# EAGLE board ESP32- 3.5 TFT Display(RGB)-V2.0 (EAGLE 9.5.1)
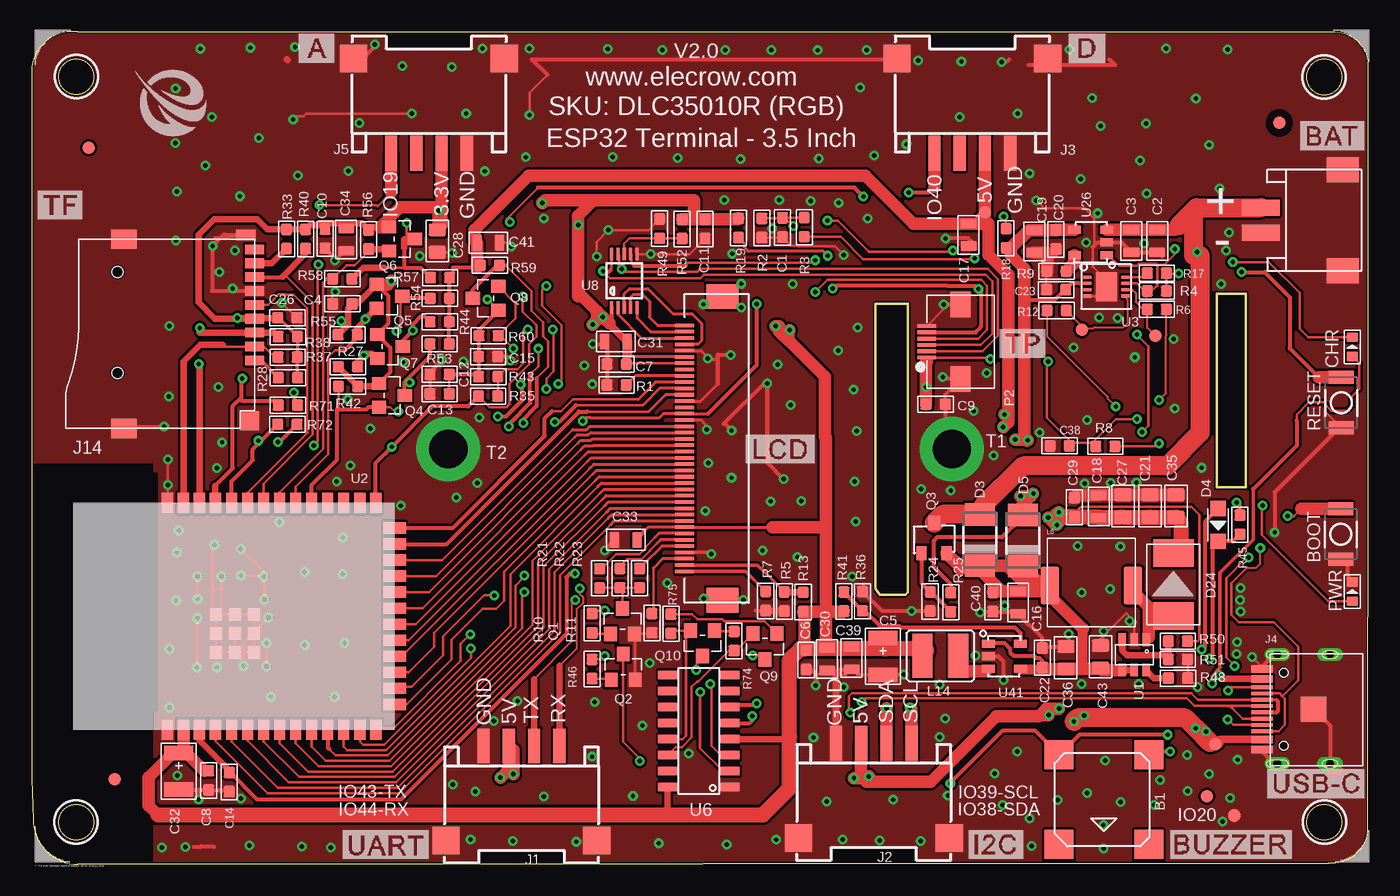
[diagram p2: board, top side]
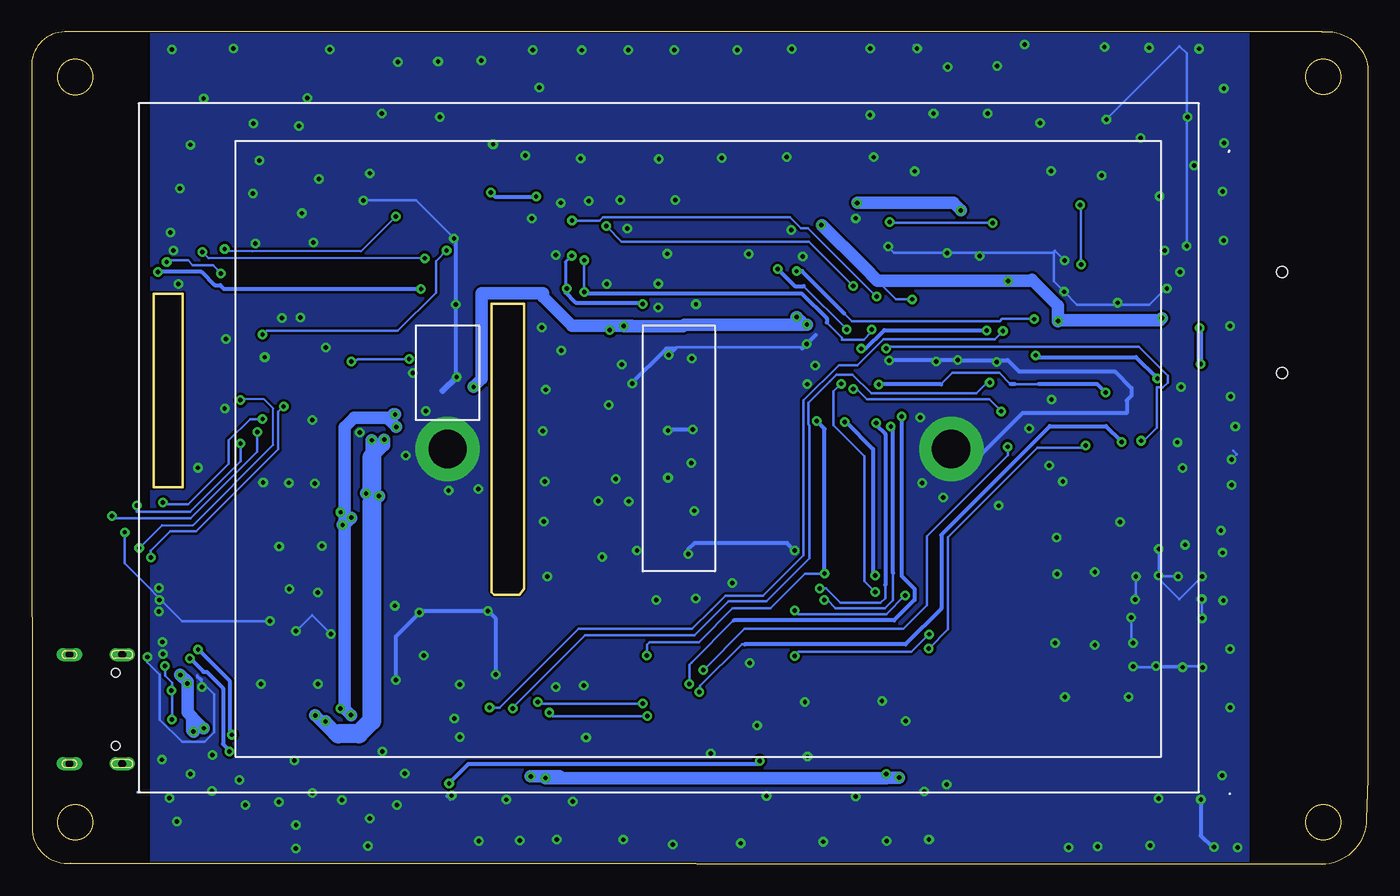
[diagram p3: board, bottom side, seen from below]

Size 106 x 66.03 mm. Coordinates in mm from the lower left corner, seen from the top.
Outline: 3.68,66 103.12,66 arc-90 106,63.49 106,36.62 105.96,2.61 arc-90 102.91,0.1 3.67,0 arc-90 0.14,3.59 0,6.77 0,63.2 arc-90 3.68,66
Outline: 94,45.26 94,29.88 96.3,29.88 96.3,45.26 94,45.26
Outline: 66.95,44.43 66.95,21.83 67.3,21.38 69.3,21.38 69.5,21.58 69.5,44.43 69.3,44.44 66.98,44.44 66.95,44.43
Outline: circle at 102.53,62.43 radius 1.4
Outline: circle at 3.56,62.46 radius 1.4
Outline: circle at 3.54,3.35 radius 1.4
Outline: circle at 102.55,3.35 radius 1.4
Copper layers (1*16): Top 0.035mm / dielectric 1.5mm / Bottom 0.035mm
Design rules "default *": minimum track width 6mil, minimum drill 0.35mm, track to track 4mil, track to pad 5mil, pad to pad 5mil, via to via 6mil, smd to smd 4mil, copper to edge 5mil, drill to drill 5mil, minimum pad ring 6mil, minimum via ring 8mil, stop-mask expansion 4mil, vias tented up to drill 30mil, thermal gap 6mil
Net classes: 0 default: width 0.127 mm, drill 0.203 mm, clearance 0.203 mm; 1 New Class: width 0.127 mm, drill 0.203 mm, clearance 0.203 mm to class 0, clearance 0.203 mm
tRestrict: area 98,57.8 to 100,59.8

## Footprints (pad centres in the part's own frame; a part is rotated, then mirrored left to right if it is on the bottom)
MLT-8530 = smd 2.3 x 2.3: 1 -3.55,3.55; 2 -3.55,-3.55; 3 3.55,-3.55; 4 3.55,3.55
2P-2.0-M = smd 1.27 x 3: 1 -1,-0.5; 2 1,-0.5 | smd 2 x 2.5: 3 -4,6; 4 4,6
157SW = smd 1.016 x 1.981: 1 0,0; 2 4,0
C0603 = smd 0.889 x 0.889: 1 -0.762,0; 2 0.762,0
0805_S = smd 0.762 x 1.27: 1 -0.889,0; 2 0.889,0
AVX-B = smd 1.143 x 2.286: + -1.46,0; - 1.46,0
DISCRETE_C0603 = smd 0.889 x 0.889: 1 -0.762,0; 2 0.762,0
0805 = smd 1.016 x 1.397: 1 -0.889,0; 2 0.889,0
0603 = smd 0.889 x 0.889: 1 -0.762,0; 2 0.762,0
LED-0603 = smd 0.762 x 0.889: + -0.762,0; - 0.762,0
DO-214AC = smd 1.8 x 2.4: A 2.025,0; C -2.025,0
SOD-323 = smd 1.2 x 1.2: 1 1.3,0; 2 -1.3,0
214AB = smd 2.2 x 3.2: 1 -2.5,0; 2 2.5,0
4P-SMD-2.0-90D = smd 0.965 x 2.74: 1 -3,-0.1; 2 -1,-0.1; 3 1,-0.1; 4 3,-0.1 | smd 2.159 x 2.184: SS1 -5.974,7.4; SS2 5.974,7.4
KEVIN_3.0TYPEC-SMD = smd 0.3 x 1.7: A1 -3.35,0.5; A4 -2.55,0.5; A5 -1.25,0.5; A6 -0.25,0.5; A7 0.25,0.5; A8 1.25,0.5; A9 2.55,0.5; A12 3.35,0.5; B1 3.05,0.5; B4 2.25,0.5; B5 1.75,0.5; B6 0.75,0.5; B7 -0.75,0.5; B8 -1.75,0.5; B9 -2.25,0.5; B12 -3.05,0.5 | drill 0.6 pad 1.016 long: P$1 -4.325,-0.72; P$2 4.325,-0.72; P$3 -4.325,-4.9; P$4 4.325,-4.9 | smd 2 x 2: P$5 0,-3.597 | hole 0.68: -2.89,-1.22; 2.89,-1.22
9P-SMD-W/-RING = smd 1.524 x 0.762: 1 0,4.4; 2 0,3.3; 3 0,2.2; 4 0,1.1; 5 0,0; 6 0,-1.1; 7 0,-2.2; 8 0,-3.3; 9 0,-4.4 | smd 1.524 x 0.8: G1 0.7,-5.546 | smd 2.032 x 1.524: G2 10.373,-5.2; G3 10.373,9.8 | smd 1.524 x 1.524: G4 0.392,9.181 | hole 0.889: 10.9,-2.6; 10.9,5.4
L773 = smd 1.5 x 3: 1 -3.29,-0.254; 2 3.29,-0.254
CD32 = smd 3.5 x 1.6: 1 0,1.409; 2 0,-1.409
TFT-3.5寸40PIN = smd 1.524 x 0.28: 1 0,9.5; 2 0,9; 3 0,8.5; 4 0,8; 5 0,7.5; 6 0,7; 7 0,6.5; 8 0,6; 9 0,5.5; 10 0,5; 11 0,4.5; 12 0,4; 13 0,3.5; 14 0,3; 15 0,2.5; 16 0,2; 17 0,1.5; 18 0,1; 19 0,0.5; 20 0,0; 21 0,-0.5; 22 0,-1; 23 0,-1.5; 24 0,-2; 25 0,-2.5; 26 0,-3; 27 0,-3.5; 28 0,-4; 29 0,-4.5; 30 0,-5; 31 0,-5.5; 32 0,-6; 33 0,-6.5; 34 0,-7; 35 0,-7.5; 36 0,-8; 37 0,-8.5; 38 0,-9; 39 0,-9.5; 40 0,-10 | smd 2.54 x 1.93: P$1 3,11.8 | smd 2.54 x 2: P$2 3,-12.3
PAD-1.0MM = smd 1 x 1: P$1 0,0
SMD8-50P-740L535W = smd 0.3 x 1.5: 1 -1.25,0; 2 -0.75,0; 3 -0.25,0; 4 0.25,0; 5 0.75,0; 6 1.25,0 | smd 2 x 1.6: 7 2.95,-2.68; 8 -2.95,-2.68
SOT23 = smd 1.016 x 1.143: 1 -0.95,-1.016; 2 0.95,-1.016; 3 0,1.016
SOT23@1 = smd 1.016 x 1.143: 1 -0.95,-1.016; 2 0.95,-1.016; 3 0,1.016
SOT-23 = smd 1.1 x 0.8: 1 1.2,-1; 2 1.2,1 | smd 1.1 x 0.9: 3 -1.2,0
R0603 = smd 0.889 x 0.889: 1 -0.762,0; 2 0.762,0
DISCRETE_R0603 = smd 0.889 x 0.889: 1 -0.762,0; 2 0.762,0
LCD3.5寸 = smd 0.305 x 0.152: P$1 0,0
3M-5 = drill 3.048 pad 5.08: 1 0,0
A_XBJ_SOT23-6 = smd 0.6 x 1: 1 -0.95,-1.2; 2 0,-1.2; 3 0.95,-1.2; 4 0.95,1.2; 5 0,1.2; 6 -0.95,1.2
ESP32-S3 = smd 1.6 x 0.9: 1 0,18.01; 2 0,16.74; 3 0,15.47; 4 0,14.2; 5 0,12.93; 6 0,11.66; 7 0,10.39; 8 0,9.12; 9 0,7.85; 10 0,6.58; 11 0,5.31; 12 0,4.04; 13 0,2.77; 14 0,1.5; 27 18,1.5; 28 18,2.77; 29 18,4.04; 30 18,5.31; 31 18,6.58; 32 18,7.85; 33 18,9.12; 34 18,10.39; 35 18,11.66; 36 18,12.93; 37 18,14.2; 38 18,15.47; 39 18,16.74; 40 18,18.01 | smd 0.9 x 1.8: 15 2,0; 16 3.28,0; 17 4.55,0; 18 5.82,0; 19 7.09,0; 20 8.36,0; 21 9.63,0; 22 10.9,0; 23 12.17,0; 24 13.44,0; 25 14.71,0; 26 16,0 | smd 1 x 1: 41 7.64,11.16; 42 9.14,11.16; 43 6.14,11.16; 44 6.14,14.16; 45 7.64,12.66; 46 9.14,12.66; 47 7.64,14.16; 48 9.14,14.16; 49 6.14,12.66
DFN8 = smd 0.61 x 0.25: 1 -1.5,0.75; 2 -1.5,0.25; 3 -1.5,-0.25; 4 -1.5,-0.75; 5 1.5,-0.75; 6 1.5,-0.25; 7 1.5,0.25; 8 1.5,0.75 | smd 1.7 x 2.3: P$9 0,0
SOP-16 = smd 0.66 x 1.5: 1 -4.445,-2.475; 2 -3.175,-2.475; 3 -1.905,-2.475; 4 -0.635,-2.475; 5 0.635,-2.475; 6 1.905,-2.475; 7 3.175,-2.475; 8 4.445,-2.475; 9 4.445,2.475; 10 3.175,2.475; 11 1.905,2.475; 12 0.635,2.475; 13 -0.635,2.475; 14 -1.905,2.475; 15 -3.175,2.475; 16 -4.445,2.475
MSOP10 = smd 0.25 x 1: 1 -1,-2.113; 2 -0.5,-2.113; 3 0,-2.113; 4 0.5,-2.113; 5 1,-2.113; 6 1,2.113; 7 0.5,2.113; 8 0,2.113; 9 -0.5,2.113; 10 -1,2.113
SOP23-5 = smd 1 x 0.635: 1 -1.27,1; 2 -1.27,0; 3 -1.27,-1; 4 1.27,-1; 5 1.27,1
SOT23-5 = smd 1 x 0.635: 1 -1.27,1; 2 -1.27,0; 3 -1.27,-1; 4 1.27,-1; 5 1.27,1

## Placement (x,y rotation side)
B1  MLT-8530  [MLT-8530]  85.05,5.13 270 top
BAT  CON-80-2P-M  [2P-2.0-M]  98,51.07 270 top
BOOT  BUTTON  [157SW]  103.84,28.2 270 top
C1  100nF  [C0603]  59.56,50.49 90 top
C2  10uF  [0805_S]  89.28,49.43 90 top
C3  10uF  [0805_S]  87.23,49.43 90 top
C4  100nF  [C0603]  24.66,44.44 0 top
C5  47uF/10v  [AVX-B]  67.53,16.49 270 top
C6  100nF  [C0603]  61.44,16.21 270 top
C7  100nF  [C0603]  46.41,39.67 180 top
C8  1uF  [C0603]  14.04,6.66 270 top
C9  100nF  [C0603]  71.71,36.48 180 top
C10  1uF  [C0603]  23.28,49.61 270 top
C11  100nF  [C0603]  53.42,50.37 90 top
C12  100nF  [C0603]  32.37,38.85 180 top
C13  100nF  [C0603]  32.36,37.3 180 top
C14  1uF  [C0603]  15.69,6.53 270 top
C15  0.1uF  [DISCRETE_C0603]  36.22,40.26 180 top
C16  10uF  [0805_S]  78.25,20.76 90 top
C17  10uF  [0805_S]  74.31,49.91 90 top
C18  10uF  [0805_S]  84.65,28.37 270 top
C19  10uF  [0805_S]  79.54,49.4 90 top
C20  100nF  [C0603]  81.25,49.54 270 top
C21  22uF  [0805]  88.71,28.41 270 top
C22  1uF  [0603]  80.17,16.38 270 top
C23  100nF  [C0603]  81.27,45.56 180 top
C26  100nF  [0603]  20.3,43.34 0 top
C27  22uF  [0805]  86.57,28.41 270 top
C28  22uF  [0805]  32.17,49.42 90 top
C29  100nF  [0603]  82.72,28.32 270 top
C30  10uF  [0805_S]  63.1,16.26 90 top
C31  10uF  [0805_S]  46.35,41.46 0 top
C32  47uF/10v  [AVX-B]  11.68,7.38 270 top
C33  10uF  [0805_S]  47.13,25.73 0 top
C34  10uF  [0805_S]  24.96,49.53 90 top
C35  22uF  [0805]  90.77,28.41 270 top
C36  22uF  [0805]  82.04,16.38 270 top
C38  100nF  [DISCRETE_C0603]  81.55,33.18 0 top
C39  10uF  [0805_S]  65.04,16.35 90 top
C40  0.1uF  [0603]  76.25,20.8 270 top
C41  10uF  [0805_S]  36.23,49.28 180 top
C43  22uF  [0805]  84.79,16.46 270 top
CHR  RED  [LED-0603]  104.75,41.03 90 top
D3  IN5817  [DO-214AC]  75.21,25.72 90 top
D4  1N5819WS  [SOD-323]  94.11,26.91 270 top
D5  SS34  [DO-214AC]  78.63,25.68 90 top
D24  SS34B/SMB  [214AB]  90.57,22.19 90 top
J1  [4P-SMD-2.0-90D]  38.86,9.29 180 top
J2  [4P-SMD-2.0-90D]  66.8,9.5 180 top
J3  [4P-SMD-2.0-90D]  74.62,56.48 0 top
J4  KEVIN_TYPEC-3.0-16P-SMD  [KEVIN_3.0TYPEC-SMD]  98.09,12.3 90 top
J5  [4P-SMD-2.0-90D]  31.52,56.48 0 top
J14  SD Card  [9P-SMD-W/-RING]  17.7,44.36 180 top
L6  33UH  [L773]  84.07,22.36 0 top
L14  CD32_950MA  [CD32]  72.08,16.53 270 top
LCD  TFT-40P-3.5  [TFT-3.5寸40PIN]  51.8,33.23 0 top
P1  PADPAD-1.0MM  [PAD-1.0MM]  98.98,58.78 0 top
P2  AFC01-S06FCC-00  [SMD8-50P-740L535W]  71,41.43 90 top
P3  PADPAD-1.0MM  [PAD-1.0MM]  6.61,6.74 0 top
P4  PADPAD-1.0MM  [PAD-1.0MM]  75.62,51.7 0 top
P5  PADPAD-1.0MM  [PAD-1.0MM]  4.53,56.83 0 top
P6  PADPAD-1.0MM  [PAD-1.0MM]  93.21,5.41 0 top
P10  PADPAD-1.0MM  [PAD-1.0MM]  93.89,9.51 0 top
P11  PADPAD-1.0MM  [PAD-1.0MM]  89.14,41.89 0 top
P12  PADPAD-1.0MM  [PAD-1.0MM]  83.31,42.4 0 top
P13  PADPAD-1.0MM  [PAD-1.0MM]  95.4,3.87 0 top
PWR  Green  [LED-0603]  104.75,21.63 90 top
Q1  NMOS7002  [SOT23]  46.87,19.29 0 top
Q2  S9013  [SOT23@1]  46.93,15.65 0 top
Q3  PMOS-3401-4A  [SOT-23]  71.58,25.87 270 top
Q4  BSN20  [SOT23]  28.59,37.18 270 top
Q5  BSN20  [SOT23]  28.39,45.05 270 top
Q6  BSN20  [SOT23]  29.38,49.58 270 top
Q7  BSN20  [SOT23]  28.44,41.05 270 top
Q8  BSN20  [SOT23]  36.01,44.88 90 top
Q9  S9013  [SOT23@1]  58.18,17.27 180 top
Q10  S9013  [SOT23@1]  53.22,17.52 180 top
R1  0R  [R0603]  46.4,38.01 180 top
R2  100K  [DISCRETE_R0603]  57.92,50.46 90 top
R3  100K  [DISCRETE_R0603]  61.29,50.52 270 top
R4  NC  [R0603]  89.25,45.46 180 top
R5  NC  [R0603]  59.7,20.84 90 top
R6  0R  [R0603]  89.25,44 180 top
R7  0R  [R0603]  58.23,20.88 90 top
R8  2K  [R0603]  85.17,33.14 180 top
R9  2K  [DISCRETE_R0603]  81.3,47.02 180 top
R10  10k  [R0603]  44.46,19.11 270 top
R11  0R  [R0603]  49.21,19.13 90 top
R12  0R  [R0603]  81.31,43.91 0 top
R13  0R  [R0603]  61.21,20.81 270 top
R17  5.1K  [DISCRETE_R0603]  89.25,46.88 180 top
R18  5.1K  [DISCRETE_R0603]  77.3,49.64 90 top
R19  10K  [DISCRETE_R0603]  56.08,50.45 90 top
R21  10R  [R0603]  45.06,22.68 90 top
R22  10R  [R0603]  46.67,22.69 90 top
R23  10R  [R0603]  48.23,22.69 90 top
R24  10K  [DISCRETE_R0603]  71.28,20.84 90 top
R25  1K  [DISCRETE_R0603]  72.91,20.78 90 top
R27  10k  [R0603]  25.09,39.45 0 top
R28  47K  [R0603]  20.34,38.59 180 top
R33  47K  [R0603]  20.22,49.58 270 top
R35  NC  [DISCRETE_R0603]  36.21,37.12 0 top
R36  22K 1%  [R0603]  65.92,20.87 270 top
R37  47K  [R0603]  20.32,40.21 0 top
R38  47K  [R0603]  20.33,41.84 0 top
R40  47K  [R0603]  21.74,49.58 90 top
R41  100K 1%  [R0603]  64.44,20.83 270 top
R42  10k  [R0603]  25.1,37.89 180 top
R43  10K  [DISCRETE_R0603]  36.22,38.67 180 top
R44  10k  [R0603]  32.38,43.02 0 top
R45  5.1R  [R0603]  95.84,26.93 270 top
R46  1K  [DISCRETE_R0603]  44.46,15.49 270 top
R48  20K  [DISCRETE_R0603]  90.94,14.77 180 top
R49  0R  [DISCRETE_R0603]  49.82,50.41 270 top
R50  73.2K  [DISCRETE_R0603]  90.91,17.7 180 top
R51  10K  [DISCRETE_R0603]  90.91,16.25 0 top
R52  NC  [DISCRETE_R0603]  51.6,50.37 90 top
R53  10k  [R0603]  32.37,41.26 0 top
R54  10k  [R0603]  32.38,44.87 0 top
R55  10k  [R0603]  25.07,42 180 top
R56  10k  [R0603]  26.73,49.54 90 top
R57  10k  [R0603]  32.4,46.51 0 top
R58  NC  [R0603]  24.66,46.43 0 top
R59  10k  [R0603]  36.34,47.48 180 top
R60  10k  [R0603]  36.25,41.91 180 top
R71  22R  [DISCRETE_R0603]  20.33,36.41 0 top
R72  470R  [DISCRETE_R0603]  20.29,34.89 0 top
R74  1K  [DISCRETE_R0603]  55.72,17.7 270 top
R75  1K  [DISCRETE_R0603]  50.71,19.07 270 top
RESET  BUTTON  [157SW]  103.88,38.62 270 top
SM  TFT-3.5  [LCD3.5寸]  97.5,5.73 0 bottom
T1  3M-5  [3M-5]  73,32.93 0 top
T2  3M-5  [3M-5]  33.05,32.93 0 top
U1  HM1548C  [A_XBJ_SOT23-6]  87.46,16.61 180 top
U2  ESP32-S  [ESP32-S3]  28.8,10.68 90 top
U3  STC8G1K08  [DFN8]  85.25,45.81 0 top
U6  CH340C  [SOP-16]  52.93,10.57 90 top
U8  NC\NS2009  [MSOP10]  47.01,46.27 0 top
U26  4054A  [SOP23-5]  84,49.31 180 top
U41  HX3406  [SOT23-5]  77.16,16.51 0 top
U$27  [LOGO]  11.58,61.49 0 top
U$53  [TOP-SMT-ESP32]  0.28,0.22 0 top

## Tracks (layer width: path | path; a pad name or v marks a point on that pad's centre or on a via)
+5V  (via drill 0.35)
  Top 0.2: 83.06,28.18 82.72,27.83 C29.2
  Top 0.203: R50.1 92.46,17.7 92.63,17.86 92.63,27.73 92,28.36 83.25,28.36 83.06,28.18 | C27.2 86.41,27.52 | P4.P$1 75.62,51.51 75.62,51.5
  Top 0.3: R53.2 33.13,43.01 R44.2 R54.2 33.14,46.5 R57.2 33.42,46.77 33.42,47.31 35.32,47.31 35.41,47.31 R59.2
  Top 1: 75.83,50.8 75.8,50.8 C17.2 69.95,50.8 66.14,54.61 39.43,54.61 35.13,50.31 35.13,49.5 C41.2 35.34,47.33 35.32,47.31 | 75.83,50.8 75.88,50.8 75.88,48.33 77.47,46.74 77.47,35.37 | 75.83,50.8 75.38,51.26 75.62,51.5 | J3.3 P4.P$1 | v77.06,34.69 77.09,34.66 77.47,35.04 77.47,35.37 | v81.33,26.92 81.33,26.98 81.9,27.55 | v80.67,11.83 79.97,11.83 | 65.95,6.84 65.77,7.02 | J2.3 65.77,9.57 65.77,7.02 | 65.77,7.02 65.59,6.84 | v37.19,6.87 37.86,7.54 J1.3 38.22,9.03 v38.22,7.15 | 79.97,11.83 79.89,11.75 76.52,11.75 71.33,6.56 66.23,6.56 65.95,6.84 | 79.97,11.83 80.48,12.34 v81.5,12.34 | v81.33,26.92 81.33,27.76 v81.48,27.92 | v65.23,6.84 65.59,6.84 | 65.59,6.84 65.95,6.84 | v66.41,6.97 66.28,6.84 65.95,6.84 | v77.17,35.67 77.47,35.37 | v81.33,26.92 81.22,26.92 v80.64,27.5
  Top 1.2: C29.2 81.9,27.55 | 84.69,27.52 82.75,27.52 C29.2 | C18.2 84.69,27.52 | 84.69,27.52 86.41,27.52 | C27.2 C21.2 C35.2 91.14,27.15 91.14,24.77 91.06,24.69 D24.2 | C29.2 81.53,27.55 81.33,27.76
  Bottom 1: v77.06,34.69 77.67,35.29 77.54,35.42 | 77.54,35.42 80.4,35.42 81.17,34.65 81.17,26.92 | v81.33,26.92 81.25,26.84 81.17,26.92 | 81.17,26.92 81.17,12.33 v80.67,11.83 | v65.23,6.84 64,6.84 | 64,6.84 38.21,6.84 38.18,6.87 v37.19,6.87 | 77.54,35.42 77.3,35.67 v77.17,35.67 | 64,6.84 64.13,6.97 v66.41,6.97 | 81.17,26.92 80.64,27.45 v80.64,27.5
BAT+  (via drill 0.35)
  Top 0.152: v92.45,48.54 92.19,48.28 92.15,48.28
  Top 0.203: R3.2 64.2,49.76 65.96,47.99 74.76,47.99 v74.82,48.05 | 92.67,48.28 92.15,48.28
  Top 0.5: D3.A 75.46,28
  Top 1: U26.3 C3.2 C2.2 | C2.2 | C2.2 90.66,50.32 91.01,50.66 | 75.46,28.42 75.46,28
  Top 1.5: BAT.1 92.41,52.07 92.15,51.8 | 91.01,50.66 92.15,51.8 | 92.15,51.8 92.15,48.28 | 92.67,48.28 92.67,34.2 90.07,31.6 78.65,31.6 75.46,28.42 | D3.A 72.25,27.74 Q3.3
  Bottom 0.152: v74.82,48.05 91.96,48.05 v92.45,48.54
DTR
  Top 0.203: R75.2 50.94,18.54 Q10.2 51.91,18.18 51.91,10.19 51.64,9.92 51.63,9.93 U6.13
EN  (via drill 0.35)
  Top 0.203: v57.19,16.56 57.87,16.56 Q9.3
  Top 0.25: R19.1 56.53,49.23 56.53,48.91 56.84,48.61 62.81,48.61 v63.16,48.26 v63.16,48.25 | 53.62,35.73 LCD.15 50.11,35.73 49.75,35.37 44.36,35.37 44.34,35.39 43.96,35.39 v43.72,35.15
  Top 0.3: P2.5 74.86,42.18 75.28,42.6 75.28,45.43 v75.1,45.6 74.85,45.86 72.7,45.86 63.75,45.86 v63.54,45.65 | C14.1 15.76,7.3 17.87,5.18 29.32,5.18 42.42,18.28 42.42,22.78 42.69,23.06 v43.11,23.06 | v95.97,46.98 95.95,46.96 97.81,46.96 99.8,44.96 99.8,40.91 102.09,38.62 | 53.62,35.73 53.64,35.73 57.53,39.62 v57.53,44.42
  Top 0.5: U2.3 13.35,10.66 13.35,9.82 15.69,7.47 C14.1
  Top 1: RESET.1 102.09,38.62
  Bottom 0.203: v43.11,23.06 44.65,23.06 47.41,20.29 50.4,20.29 53.07,17.62 56.99,17.62 57.19,17.42 v57.19,16.56
  Bottom 0.25: v63.16,48.25 63.65,47.76 63.65,45.34 63.54,45.45 v63.54,45.65
  Bottom 0.3: v75.1,45.6 75.11,45.61 90.72,45.61 91.03,45.92 91.46,45.92 92.52,46.98 v95.97,46.98 | v43.11,23.06 43.11,34.52 43.72,35.13 v43.72,35.15 | v57.53,44.42 57.65,44.54 62.85,44.54 63.65,45.34
GHRG  (via drill 0.35)
  Top 0.152: 89.19,45.78 88.44,45.03 88.44,45.02 | R18.2 77.3,51.17 v77.11,51.36 | v90.68,48.8 90.68,48.37 89.87,47.56 89.28,47.56
  Top 0.203: U26.1 85.41,48.31 86.27,47.45 87.66,47.45 87.84,47.64 89.2,47.64 89.28,47.56 89.28,46.28 89.29,46.28 89.29,45.88 89.19,45.78 | U3.7 87.65,46.06 88.5,45.21 88.51,45.21 88.44,45.14 88.44,45.02 88.49,45.07 R4.2
  Bottom 0.152: v77.11,51.36 79.86,48.61 88.49,48.61 88.5,48.61 90.57,48.61 90.68,48.72 v90.68,48.8
GND  (via drill 0.35)
  Top 0.152: C23.2 80.51,46.96 80.57,47.02
  Top 0.203: 103.79,34.7 102.59,35.91 102.59,35.38 | v10.52,34.72 7.49,34.72 J14.G3 | 14.38,21.79 15.09,21.79 | U2.49 U2.43 U2.41 U2.42 U2.46 15.09,19.82 15.09,21.79 | U2.49 U2.44 U2.48 14.38,19.82 14.38,21.79 | U2.49 U2.45 | 10.79,28.47 U2.40 10.79,32.06 v10.82,32.09 | 14.38,24.88 14.38,21.79 | 27.3,64.93 v27.23,64.99 | 40.91,62.59 39.5,61.18 v39.5,59.42 | 15.09,21.79 15.09,22.73 15.07,22.75 v15.07,22.82 | v16.62,22.9 18.32,22.9 v18.41,22.81 | v18.48,20.99 18.48,23.1 v16.59,24.99 | v13.16,22.81 13.16,21.04 v13.18,21.02 | v13.16,19.51 13.12,19.47 v13.12,15.59 | v18.78,19.58 16.79,17.59 v16.79,15.71 | v18.62,17.56 18.64,17.53 v18.64,15.7 | 73.77,43.6 P2.7 | R2.1 59.53,49.7 C1.1 60.24,49.05 60.77,49.05 60.8,49.02 63.71,49.02 v64.41,48.32 | Q1.2 47.97,18.27 | 47.97,18.27 49.11,18.27 R11.1 | C15.1 37.03,40.27 37.98,40.27 38.15,40.09 | Q2.2 47.88,18.18 47.97,18.27 | 62.22,15.07 62.79,15.07 C30.1 64.2,15.38 | 61.84,15.45 C6.2 | 63.84,15.02 64.59,15.02 C39.1 65.48,15.03 C5.- | R51.2 91.7,16.22 R48.1 | C28.1 33.32,48.53 v33.37,48.48 | v38.07,48.97 37.76,49.28 C41.1 | v24.09,45.4 23.85,45.16 23.85,44.48 | C26.2 21.04,43.34 v19.85,44.53 | v15.96,45.66 15.75,45.46 J14.6 | v20.75,59.07 21,59.32 21.57,59.32 21.77,59.52 v30.15,59.52 | v44.83,48.18 44.83,48.06 44.8,48.06 44.8,49.34 v45.74,50.29 48.95,50.29 R49.1 | 84.3,49.07 84.3,51.19 83.49,52 80.34,52 v79.69,52.65 | U1.2 87.46,19.07 87.58,19.19 86.84,19.93 84.79,17.87 C43.1 85.02,17.58 v85.02,18.49 | R48.1 92.04,14.77 | C36.1 82.26,17.5 v82.26,18.27 82.26,18.18 | U8.6 v49.11,48.38 52.19,48.38 C11.1 | P2.6 72.33,44.01 v72.33,44.38 | 80.52,47.01 R9.2 | C2.1 89.67,48.15 | C13.2 C12.2
  Top 0.203: R48.1 91.78,14.77 v92.49,14.06 v92.5,14.06 | v96.79,16.45 J4.A12 J4.B1 | 84.17,48.94 84.17,47.37 85.25,46.29 U3.P$9 85.25,45.22 85.04,45.01 84.99,45.06 U3.4
  Top 0.25: LCD.16 53.09,35.23 53.55,34.77 v53.55,34.49 | LCD.13 53.07,36.73 54.43,38.1 | LCD.5 53.11,40.73 53.65,40.19 | v53.62,40.11 53.72,40.01 54.41,40.01 54.43,39.98 | 65.99,22.24 65.99,21.7 R36.1
  Top 0.28: LCD.37 53.79,24.73 v53.91,24.6 | P2.8 72.47,37.27 C9.1 72.47,33.46 T1.1
  Top 0.3: v55.45,40.38 55.41,40.42 54.43,40.42 54.43,39.98 54.43,38.1 | C31.1 45.65,41.27 | 45.65,41.27 C7.2 R1.2 | v55.52,34.4 54.99,34.92 54.88,34.92 58.36,38.4 v58.36,38.12 58.36,31.83 v59.65,30.54 | J14.G1 14.6,49.65 | 23.85,44.48 C4.1 | v44.52,41.25 45.63,41.25 45.65,41.27 | 26.2,63.83 27.31,64.94 | 40.91,62.59 39.67,63.83 68.32,63.83 68.79,63.37 68.79,63.46 | 85.48,63.83 85.95,63.37 79.1,63.37 | 77.39,63.66 77.55,63.83 | P2.7 v72.33,44.38 | C32.- 13.26,5.92 | 13.26,5.92 14.02,5.92 C8.2 15.57,5.89 C14.2 | 14.46,1.38 13.48,1.38 | 13.48,1.45 13.48,1.38 | 12.88,1.38 13.48,1.38 | 13.26,5.92 v13.26,5.14 | P2.8 72.44,38.48 v72.28,38.64 | v72.49,49.63 72.51,49.65 74.28,49.65 74.61,49.32 C17.1 | v98.61,26.33 98.61,29.52 103.79,34.7 RESET.2 104.31,34.19 | BOOT.2 103.05,24.2 | 103.94,7.49 103.7,7.25 102.89,7.25 | U6.1 55.75,6.12 | J4.A12 98.56,16.63 J4.P$2 | J4.P$5 102.99,11 J4.P$3 | J4.P$1 98.56,7.98 J4.A1 J4.B12 | J14.6 14.31,45.46 14.31,48.97 v14.37,49.03 15.28,49.94 J14.G1 | C36.1 80.3,17.27 C22.1 80.17,17.95 C16.1 78.08,20.04 C40.2 75.31,20.04 v75.22,19.96 | R24.1 v69.8,20.08 67.47,20.08 R36.1 | PWR.- 104.41,22.92 104.41,24.11 104.33,24.2 BOOT.2 | BOOT.2 103.8,24.16 | 84.17,48.94 84.3,49.07 84.54,49.31 U26.2 86.46,49.31 C3.1 C2.1 | C2.1 | C10.2 24.06,48.07 v24.06,47.87 24.84,48.64 C34.1 | J14.G1 16.42,49.9 16.37,49.85 | C12.2 31.61,39.03 v32.55,39.97 | v37.99,39.93 37.66,40.27 37.03,40.27 | C5.- 69.14,15.03 v69.17,15.05 | U41.2 76.67,16.51 77.07,16.11 77.07,14.61 v77.1,14.61 | 57.44,20.12 R7.1 | 59.33,20.04 59.25,20.12 | 61.84,15.45 62.22,15.07 62.23,15.06 62.23,14.17 v62.21,14.17 | C33.1 45.47,24.96 v45.47,24.87
  Top 0.5: C10.2 23.08,48.65 | 20.33,63.74 20.24,63.83 | 25.96,63.74 25.87,63.83 | R5.1 59.67,20.12 59.25,20.12 R7.1 | J2.4 63.8,14.98 63.84,15.02 64.2,15.38
  Top 1: C35.1 C21.1 C27.1 84.69,29.3 C18.1 82.9,29.26 C29.1 | C19.1 80.57,48.51 80.57,47.02 R9.2 | 80.98,48.51 C20.2
  Bottom 0.203: 66.96,56.08 v66.85,56.19 | 36.02,64.95 v35.77,64.7 | 10.69,32.8 10.4,32.51 v10.82,32.09 | v15.07,22.82 15.09,22.84 16.6,22.84 16.62,22.86 v16.62,22.9 | v18.41,22.81 18.41,21.06 v18.48,20.99 | v16.59,24.99 16.59,22.66 14.95,21.02 v13.16,22.81 | v13.18,21.02 13.18,19.53 v13.16,19.51 | v16.79,15.71 13.24,15.71 v13.12,15.59 | v18.62,17.56 18.78,17.73 v18.78,19.58 | v18.64,15.7 18.57,15.63 v14.71,15.63 | v38.07,48.97 37.58,48.48 v33.37,48.48 25,48.48 24.91,48.58 | 24.91,48.58 24.84,48.64 v24.06,47.87 | 24.91,48.58 24.91,46.22 v24.09,45.4 23.07,44.38 19.85,44.38 | 19.85,44.38 v19.85,44.53 | 19.85,44.38 17.34,44.38 16.12,45.6 16.02,45.6 v15.96,45.66 | v14.37,49.03 14.37,64.3 14.95,64.88 v20.75,59.07 | v44.83,48.18 45.04,48.39 | v49.11,48.39 v49.11,48.38 | v79.69,52.65 75.5,52.65 v72.49,49.63 | v82.26,18.27 83.75,19.76 v85.02,18.49 | 54.95,40.88 54.85,40.99 44.78,40.99 | v92.5,14.06 92.5,14.66 92.85,15.01 92.85,14.82 91.53,13.5 91.53,10.46 92.27,9.71 94.05,9.71 95.82,11.48 95.82,15.04 96.81,16.03 96.81,16.43 v96.79,16.45 | v98.61,26.33 98.61,23.86 94.03,19.28 v87.1,19.28
  Bottom 0.3: 44.86,40.91 44.78,40.99 v44.52,41.25 43.81,41.97 | v55.45,40.38 54.95,40.88 55.66,40.88 58.56,37.97 58.51,37.97 v58.36,38.12 | v13.26,5.14 13.26,2.28 12.37,1.38 v12.2,1.38 | v55.52,34.4 55.43,34.49 v53.55,34.49 | v72.28,38.64 72.33,38.69 v72.33,44.38 72.33,49.51 72.45,49.63 v72.49,49.63 | 72.76,5.19 73.01,5.43 72.98,5.46 v72.68,5.46 | v37.99,39.93 37.94,39.93 37.9,39.97 v32.55,39.97 28.58,39.97 27.69,39.08 20.09,39.08 18.76,37.75 18.76,37.17 19.14,36.79 19.14,35.77 27.41,35.77 30.7,32.48 32.6,32.48 T2.1 | v69.17,15.05 69.17,19.46 69.8,20.09 v69.8,20.08 75.34,20.08 v75.22,19.96 77.1,18.08 v77.1,14.61 | v62.21,14.17 62.03,14.35 | v45.47,24.87 46.07,25.47 53.41,25.47 53.91,24.97 v53.91,24.6
  Bottom 0.5: v72.28,38.64 73.39,37.53
  other vias: 53.32,21.09 55.52,30.65 62.45,55.95 21.11,54.62 11.67,26.46 19.65,27.16 24.67,23.01 24.8,17.55 10.94,17.06 10.94,12.42 16.61,5.23 10.82,30.09 24.7,25.9 44.49,38.07 43.83,39.56 55.59,48.41 53.3,44.41 14.51,25.34 11.54,24.71 11.48,20.93 21.67,23.18 21.67,17.38 69.39,57.09 39.48,64.69 45.69,64.64 50.03,64.57 55.01,64.57 11.58,7.05 58.66,64.56 62.35,64.55 66.25,64.57 65.74,61.6 70.34,63.72 73.75,63.65 76.95,63.62 82.33,64.59 93.39,57.05 87.94,55.79 89.97,64.69 78.21,59.52 94.88,64.62 83.74,35.21 92.35,60.71 84.11,60.77 87.51,40.2 95.88,21.91 94.35,46.02 95.61,17.64 65.2,37.63 53.68,31.83 59.2,39.63 81.38,5.09 77.04,4.71 72.01,10.11 93.41,7.15 94.46,3.41 83.72,5.64 85.01,3.13 91.71,5.82 79.33,1.45 68.34,5.12 70.52,1.85 67.27,1.91 64.35,1.98 59.05,1.95 55.16,1.58 49.76,1.67 43.19,1.79 38.16,1.85 34.82,1.96 23.75,1.34 21.43,1.4 17.29,1.49 10.34,1.34 10.89,37.11 65.45,34.35 63.97,40.74 19,13.29 24.04,13.28 16.52,52.97 10.94,42.67 18.02,57.6 35.36,30.25 11.43,61.52 39.21,56.07 51.27,56.01 13.41,64.66 17.37,64.74 20.91,64.81 29.41,63.29 33.34,63.22 25.15,54.98 13.78,55.41 56.3,44.15 79.18,54.79 94.24,53.59 83.22,54.34 95.56,16.69 56.44,20.97 95.66,8.3 24.2,30.35 33.71,29.07 75.77,38.95 84.78,58.56 46.1,56.07 56.23,55.93 11.4,57.18 36.68,11.36 58.64,28.79 73.63,59.25 88.41,58.74 14.3,59.26 14.7,31.42 44.66,12.88 38.55,12.96 49.04,15.97 48.46,11 44.46,8.53 33.41,6.32 25.3,31.63 29.29,28.43 26.88,34.56 14.81,37.84 15.12,33.46 11.52,53.35 14.89,46.97 11.47,49.45 25.99,58.79 35.94,54.95 34.47,59.54 40.64,51.22 54.93,52.66 59.32,52.66 64.03,52.45 61.79,52.58 56.3,46.03 60.39,46.01 65.53,42.57 53.45,28.03 65.37,27.19 60.75,24.35 57.98,24.88 95.86,20.96 95.89,20.06 79.97,34.24 86.14,43.31 90.68,36.14 60.21,36.43 66.33,51.19 83.52,30.19 85.6,30.25 87.63,30.27 92.79,31.44 82.98,25.23 86.36,25.2 83.28,21.55 77.18,20.5 74.89,16.55 64.43,14.06 65.08,22.83 52.13,8.78 47.71,5.42 40.64,5.39 35.2,5.76 62.02,10.04 63.07,4.99 72.47,11.55 91.66,8.68 85.14,8.24 76.39,7.19 78.16,8.96 89.03,4.69 95.05,5.27 86.37,4.93 79.17,3.64 85.54,21.82 61.04,28.79 84.66,43.34 94.98,50.08 87.81,14.3 94.76,48.66 88.44,53.17 84.56,51.62 83.63,49.29 88.24,49.21 90.58,41.66 16.12,48.65 30.79,48.23 35.53,35.41 58.75,50.42 50.43,22.29 83.29,14.3 72.03,14.26 85.03,1.26 89.5,6.7 74.74,35.94 76.31,32.41 72.92,29.64 70.55,29.76 65.28,30.36 82.66,40.96 29.47,39.83 25.11,36.84 34.25,39.86
  pour Bottom (no thermals): 9.5,-0.25 96.5,-0.25 96.5,66.91 9.5,66.91 9.5,31.83 9.5,30.62 9.5,30.59 9.5,12.24 9.5,12.08
  pour Top (no thermals): -0.69,31.87 9.79,31.87 9.79,31.17 10.14,31.17 10.14,12.33 9.78,11.96 9.78,-0.22 106.76,-0.22 107.16,0.18 107.16,66.11 106.84,66.42 -0.36,66.42
GPIO0  (via drill 0.35)
  Top 0.203: R35.1 36.32,36.25 37.66,36.25 37.92,36.51 37.92,38.11 38.7,38.89 38.72,38.89 39.48,39.65 39.48,41.23 40.06,41.81 40.06,42.73 38.96,43.83 v38.96,45.02 | v63.13,51.03 63.96,51.03 66.38,48.61 66.38,48.59 66.4,48.57 73.19,48.57 v73.08,48.68 | v99.61,27.61 100.13,27.61 100.71,28.2 | v88.1,34.28 88.58,34.76 88.58,41.1 v87.67,42 | Q10.3 53.22,16.35 52.49,15.63 v52.72,15.4
  Top 0.3: U2.27 27.3,31.82 v28.59,33.11 31.79,36.31 34.64,36.31 R35.1
  Top 1: 100.71,28.2 BOOT.1
  Bottom 0.203: v38.96,45.02 39,45.02 44.42,50.44 44.98,50.44 44.98,50.45 45.84,51.31 60.66,51.31 60.94,51.03 v63.13,51.03 | v88.1,34.28 88.1,32.72 93.38,27.44 99.44,27.44 v99.61,27.61 | v73.08,48.68 73.93,47.83 73.93,45.32 76.96,42.29 84.72,42.29 84.73,42.3 87.37,42.3 v87.67,42 | v52.72,15.4 49.44,18.68 36.86,18.68 35,20.54 35,26.02 28.57,32.45 28.57,32.92 28.61,32.96 28.61,33.08 v28.59,33.11
GPIO1-CS
  Top 0.203: R37.1 19.3,40.21 18.55,40.97 17.79,40.97 J14.2 15.3,41.06 15.16,41.19
  Top 0.5: U2.39 12.06,39.89 13.36,41.19 15.16,41.19
GPIO2-MOSI  (via drill 0.35)
  Top 0.5: R38.1 19.24,42.16 J14.3 13.34,42.16 v13.34,42.53 | U2.38 13.33,39.59 v13.26,39.66 v13.26,39.67
  Bottom 0.5: v13.34,42.53 13.34,39.59 v13.26,39.67
GPIO3-DB8
  Top 0.203: 44.69,30.4 37.48,23.2 37.48,20.91 36.84,20.28 35.78,20.28 33.32,17.81 33.32,16.25 29.75,12.68 U2.15
  Top 0.25: 44.69,30.4 45.01,30.73 LCD.25
GPIO4-DB15
  Top 0.203: U2.4 14.6,9.77 18.73,5.64 29.14,5.64 41.9,18.4 41.9,22.93 45.91,26.94
  Top 0.25: 45.91,26.94 46.2,27.23 LCD.32
GPIO5-DB14
  Top 0.203: U2.5 15.87,9.72 19.51,6.07 29.03,6.07 41.47,18.51 41.47,23.16 45.73,27.42
  Top 0.25: 45.73,27.42 46.04,27.73 LCD.31
GPIO6-DB13
  Top 0.203: U2.6 17.14,9.79 20.41,6.52 28.92,6.52 41.04,18.64 41.04,23.38 45.59,27.92
  Top 0.25: 45.59,27.92 45.9,28.23 LCD.30
GPIO7-DB12
  Top 0.203: U2.7 18.41,9.73 21.21,6.94 28.78,6.94 40.63,18.79 40.63,23.62 45.43,28.42
  Top 0.25: 45.43,28.42 45.74,28.73 LCD.29
GPIO8-DB9
  Top 0.203: 44.9,29.92 37.98,22.99 37.98,18.93 28.11,9.07 25.03,9.07 24.76,9.33 U2.12
  Top 0.25: 44.9,29.92 45.21,30.23 LCD.26
GPIO9-DB7
  Top 0.203: U2.17 29.89,15.23 31.92,17.26 31.92,18.35 44.49,30.92
  Top 0.25: 44.49,30.92 44.8,31.23 LCD.24
GPIO10-DB6
  Top 0.203: 44.29,31.42 29.37,16.5 U2.18
  Top 0.25: 44.29,31.42 44.6,31.73 LCD.23
GPIO11-DB5
  Top 0.203: U2.19 29.92,17.77 44.07,31.92
  Top 0.25: 44.07,31.92 44.38,32.23 LCD.22
GPIO12-DB4
  Top 0.203: U2.20 30.46,19.04 43.83,32.41
  Top 0.25: 43.83,32.41 44.15,32.73 LCD.21
GPIO13-DB3
  Top 0.203: U2.21 31,20.31 43.6,32.91
  Top 0.25: 43.6,32.91 43.88,33.19 44.53,33.19 44.58,33.23 LCD.20
GPIO14-DB2
  Top 0.203: U2.22 31.52,21.58 43.37,33.42
  Top 0.25: 43.37,33.42 43.56,33.62 44.36,33.62 44.47,33.73 LCD.19
GPIO15-DB11
  Top 0.203: U2.8 19.68,9.61 21.94,7.36 28.65,7.36 40.19,18.89 40.19,23.86 45.26,28.92
  Top 0.25: 45.26,28.92 45.57,29.23 LCD.28
GPIO16-DB10
  Top 0.203: U2.9 20.95,9.6 22.77,7.78 28.52,7.78 39.76,19.01 39.76,24.08 45.09,29.41
  Top 0.25: 45.09,29.41 45.41,29.73 LCD.27
GPIO17  (via drill 0.35)
  Top 0.203: C1.2 59.53,51.22 R2.2 | U2.10 22.22,9.31 23.33,8.2 28.4,8.2 38.92,18.72 38.92,21.42 v39.08,21.58 | v41.77,38.1 42.03,38.36 42.03,42.75 40.51,44.27 40.51,45.54 v40.82,45.85 | v60.41,50.6 59.76,51.25 C1.2 | C1.2 61.26,51.25 R3.1
  Bottom 0.203: v39.08,21.58 39.93,22.43 39.93,32.36 42.38,34.81 42.38,37.49 v41.77,38.1 | v40.82,45.85 44.35,49.38 59.19,49.38 v60.41,50.6
GPIO18  (via drill 0.35)
  Top 0.203: 48.5,36.42 43.18,36.42 | v39.08,22.89 39.08,22.79 38.4,22.11 38.4,18.78 28.25,8.63 24.12,8.63 23.61,9.14
  Top 0.25: LCD.11 49.81,37.73 48.5,36.42
  Top 0.3: U2.11 | U2.11 23.49,9.26 23.61,9.14 | 43.18,36.42 41.83,35.06 v41.5,35.06
  Bottom 0.3: v41.5,35.06 41.45,35.11 39.26,32.92 39.26,23.07 v39.08,22.89
GPIO20_BUZZER  (via drill 0.35)
  Top 0.203: U2.14 27.37,10.75 28.66,10.75 34.05,16.14 34.05,17.48 v34.81,18.24 | v45.48,16.53 45.2,16.25 R46.1
  Bottom 0.203: v34.81,18.24 36.2,16.85 45.16,16.85 v45.48,16.53
GPIO21-DB1
  Top 0.203: U2.23 32.07,22.85 43.1,33.88
  Top 0.25: 43.1,33.88 43.26,34.04 44.18,34.04 44.37,34.23 LCD.18
GPIO38-SDA  (via drill 0.35)
  Top 0.203: 26.73,36.24 28.46,36.24 28.78,35.92 v29.08,35.92 | v40.84,37.68 40.84,38.51 41.41,39.08 41.41,42.34 v41.34,42.42 | U8.9 46.61,48.28 46.61,47.22 46.67,47.15 | 46.78,47.05 46.84,46.99 52.81,46.99 53.02,47.21 75.85,47.21 76.65,46.41 76.65,41.93 75.41,40.68 P2.2 | R42.2 24.34,36.16 24.23,36.05
  Top 0.3: 46.78,47.05 46.74,47.09 | 46.67,47.15 46.74,47.09 | 46.74,47.09 46.74,47.11 v46.81,47.19 | U2.31 22.22,30.08 24.23,32.09 24.23,36.05 26.54,36.05 26.73,36.24 Q4.2
  Bottom 0.203: v29.08,35.92 30.02,36.86 39.72,36.86 40.54,37.68 v40.84,37.68 | 44.76,45.84 v41.34,42.42
  Bottom 0.3: v46.81,47.19 45.46,45.84 44.76,45.84
GPIO38-SDA-  (via drill 0.35)
  Top 0.203: v29.99,38.19 29.6,38.19 | 67.82,9.62 J2.2
  Top 0.3: Q4.3 29.6,38.19 29.6,38.28 31.61,40.28 R53.1
  Top 1: v67.82,12.36 67.82,9.62
  Bottom 0.203: v29.99,38.19 30.24,38.19 31.07,37.36 39.4,37.36 40.88,38.84 42.17,38.84 42.69,38.32 42.69,38.29 44.38,36.6 44.38,34.88 44.29,34.79 44.29,24.26 47.7,20.85 50.74,20.85 53.43,18.16 62.1,18.16 67.77,12.49 67.77,12.31 v67.82,12.36
GPIO39-SCL  (via drill 0.35)
  Top 0.203: U8.10 46.01,47.2 45.96,47.15 | 45.58,46.77 45.87,46.49 53.06,46.49 53.33,46.75 75.71,46.75 76.22,46.25 76.22,42.09 75.31,41.18 P2.3 | U2.32 20.95,29.93 23.55,32.53 23.55,40.23 24.07,40.75 24.7,40.75
  Top 0.3: 45.96,47.15 45.58,46.77 v45.33,47.03 | R55.1 25.83,41.75 24.84,40.75 24.7,40.75
  Top 0.5: R55.1 25.83,42.49 26.47,43.13 v26.47,43.22 27.35,44.1 Q5.2
  Bottom 0.203: 41.56,43.7 40.94,43.07 29.21,43.07 29.04,43.24 26.47,43.24 v26.47,43.22
  Bottom 0.3: v45.33,47.03 44.89,47.03 41.56,43.7
GPIO39-SCL-  (via drill 0.35)
  Top 0.203: Q5.3 29.4,44.9 29.27,44.77 29.27,42.59 v28.96,42.27 | v69.67,12.42 69.8,12.29
  Top 0.3: R54.1 29.58,44.87 Q5.3
  Top 1: 69.8,12.29 J2.1
  Bottom 0.203: v28.96,42.27 29.58,41.65 38.42,41.65 40.49,39.58 41.97,39.58 44.76,36.79 44.76,24.51 47.98,21.29 50.96,21.29 52.06,20.19 52.07,20.19 53.6,18.66 62.63,18.66 68.87,12.42 v69.67,12.42
GPIO40
  Top 0.203: U2.33 19.68,29.51 23.13,32.96 23.13,46.13 23.43,46.43 | R58.1 24.98,47.5 25.63,47.5 26.73,48.6 R56.1
  Top 0.3: 23.43,46.43 R58.1
  Top 0.5: R56.1 28.2,48.78 Q6.2
GPIO40-  (via drill 0.35)
  Top 0.203: 40.16,53.65 37.7,51.19 37.7,50.98 37.76,50.92 v37.93,50.92 | v29.76,50.85 29.76,49.52 29.56,49.32 | 27.98,47.29 29.58,47.29
  Top 0.3: v69.56,53.25 71.15,53.25 71.62,53.72 | v65.98,52.94 65.27,53.65 40.16,53.65 | R57.1 30.86,47.29 29.58,47.29 29.56,47.31 29.56,48.87
  Top 0.5: Q6.3 29.56,49.58 29.56,49.32 29.56,48.87 | R58.2 26.29,47.29 27.98,47.29
  Top 1: J3.1 71.62,53.72
  Bottom 0.203: v37.93,50.92 37.86,50.85 v29.76,50.85
  Bottom 0.3: v69.56,53.25 69.25,52.94 v65.98,52.94
GPIO41-MISO
  Top 0.203: U2.34 18.41,30.19 22.3,34.08 22.3,44.52 20.22,46.6 19.91,46.6
  Top 0.3: J14.7 19.86,46.56 19.91,46.6
  Top 0.5: R40.1 21.74,48.43 19.91,46.6
GPIO42-SCLK
  Top 0.203: J14.5 18.78,44.36 19.19,44.76 19.19,44.8 19.58,45.18 20.12,45.18 20.13,45.17 20.8,45.17 21.87,44.1 21.87,34.23 21.89,34.23 17.14,29.48 U2.35
GPIO45
  Top 0.203: 48.13,36.87 42.96,36.87 42.02,35.93 41.28,35.93
  Top 0.25: LCD.10 49.49,38.23 48.13,36.87
  Top 0.3: U2.26 33.42,26.68 40.71,33.97 40.71,35.35 41.28,35.93
GPIO46  (via drill 0.35)
  Top 0.203: U2.16 28.9,14.06 30.15,14.06 32.66,16.57 32.66,18.1 35.88,21.32 v36.71,21.32 | v45.46,20.12 44.71,20.12 R10.1
  Bottom 0.203: v36.71,21.32 v36.72,21.33 38.21,19.83 45.17,19.83 v45.46,20.12
GPIO47-DB0
  Top 0.203: U2.24 28.83,24.09 32.55,24.09 42.88,34.42
  Top 0.25: LCD.17 44.26,34.73 44,34.47 42.93,34.47 42.88,34.42
GPIO48-RD
  Top 0.203: 44.09,35.9 48.95,35.9
  Top 0.25: 48.95,35.9 50.29,37.23 LCD.12
  Top 0.3: U2.25 32.92,25.39 43.42,35.9 44.09,35.9
GPIO-19  (via drill 0.35)
  Top 0.203: U2.13 26.07,10.64 26.07,9.72 26.31,9.48 27.96,9.48 34.85,16.38 34.85,17.11 v34.83,17.11 | v22.76,47.56 22.71,47.51 22.71,33.53 v22.38,33.2 | v22.82,52.27 27.37,52.27 27.45,52.19 28.54,53.28 | 28.54,56.36 J5.1
  Top 1: 28.54,53.28 28.54,56.36
  Bottom 0.203: v34.83,17.11 33.3,18.64 33.3,25.95 26.21,33.04 22.54,33.04 v22.38,33.2 | v22.76,47.56 22.76,52.29 22.78,52.31 v22.82,52.27
IM0
  Top 0.203: R11.2 49.32,20 49.32,23.49
  Top 0.25: LCD.38 50.06,24.23 49.32,23.49
IM1
  Top 0.25: 58.24,23.06 R5.2
  Top 0.28: LCD.39 57.57,23.73 58.24,23.06
  Top 0.5: R13.1 59.73,21.57 R5.2
IM2
  Top 0.25: 57.29,22.58 R7.2
  Top 0.28: LCD.40 56.64,23.23 57.29,22.58
K
  Top 0.203: R21.1 45.08,21.93 R22.1 46.84,21.93 | 46.84,21.93 R23.1 | Q1.3 46.87,21.9 46.84,21.93
LED
  Top 0.203: U3.8 88.17,46.56 R17.2
N$3
  Top 0.203: Q1.1 44.54,18.27 R10.2
N$4
  Top 0.28: J14.1 18.21,39.96 R28.2
N$5  (via drill 0.35)
  Top 0.203: R8.1 89.17,33.14 v89.41,33.38 v89.42,33.38 | PWR.+ 102.84,20.87 97.56,26.15 97.56,28.37 v97.64,28.45
  Bottom 0.203: v89.42,33.38 89.42,31.95 93.42,27.94 97.64,27.94 v97.64,28.45
N$6
  Top 0.203: 49.45,25.92 48.68,25.16 48.68,25.04 48.23,24.58 46.34,24.58 45.2,23.44 R21.2
  Top 0.25: 49.45,25.92 49.76,26.23 51.2,26.23 LCD.34
N$7
  Top 0.203: R22.2 46.67,23.62 47.25,24.2 48.39,24.2 49.06,24.88 49.06,24.91 49.58,25.42
  Top 0.25: 49.58,25.42 49.89,25.73 51.2,25.73 LCD.35
N$8  (via drill 0.35)
  Top 0.203: Q2.3 46.93,9.7 48.34,8.29 v48.26,8.2
  Top 0.3: D4.2 93.06,27.16 93.06,17.29 92.8,17.03 v92.78,17.05 | v90.09,10.27 83.09,10.27 B1.2 81.5,8.72 79.63,10.59 77.02,10.59 72.88,6.45 v72.88,6.41
  Bottom 0.3: v72.88,6.41 71.36,7.94 48.26,7.94 v48.26,8.2 | v92.78,17.05 90.3,14.56 90.3,10.19 90.18,10.19 v90.09,10.27
N$9
  Top 0.203: 48.23,23.5 R23.2
  Top 0.25: LCD.36 49.99,25.23 48.56,23.8 48.52,23.8 48.23,23.5
N$10
  Top 0.25: LCD.9 47.89,38.73 R1.1
N$11  (via drill 0.35)
  Top 0.203: R4.1 R17.1 90.05,46.84 v90.98,46.84 | v95.28,47.75 98.15,47.75 100.58,45.32 100.58,42.46 101.25,41.79 CHR.-
  Bottom 0.203: v90.98,46.84 91.25,47.11 91.18,47.11 91.58,47.52 93.2,47.52 93.57,47.88 95.05,47.88 95.18,47.75 v95.28,47.75
N$12
  Top 0.203: U1.1 88.61,18.01 | 87.52,21.48 87.28,21.48 87.28,22.03 L6.2 | 88.69,19.69 88.61,19.69 | 88.62,19.76 88.69,19.69 | D24.1 88.69,19.69
  Top 1: 88.61,19.69 88.61,18.01 | 88.62,19.76 88.62,20.39 87.52,21.48
N$13  (via drill 0.35)
  Top 0.3: R45.2 95.28,25.61 D4.1 93.65,25.15 93.65,16.55 v93.42,16.32 | v90.31,8.95 88.86,8.95 B1.1
  Bottom 0.3: v93.42,16.32 92.36,15.26 92.1,15.26 90.8,13.96 90.8,9.54 90.25,9 v90.31,8.95
N$14
  Top 1: R9.1 82.73,47.69 U26.5
N$16
  Top 0.152: U3.6 87.31,45.56 87.57,45.3 87.57,44.59 88.16,44 R6.2 88.49,42.54 P11.P$1
N$17
  Top 0.3: Q3.1 70.58,22.29 R24.2 71.33,21.6 R25.1
N$18
  Top 0.152: P12.P$1 83.28,42.43 83.17,42.43 83.23,42.49 83.4,42.49 | 83.4,42.49 84.21,42.49 84.31,42.59 86.6,42.59 86.96,42.95 86.96,44.76 86.75,44.97 U3.5 | R12.2 83.4,42.58 83.4,42.49
N$23
  Top 0.5: J14.8 19.06,47.66 R33.2
N$25
  Top 0.203: U8.8 47.01,49.22 47.43,49.64 R49.2 51.57,49.64
  Top 0.5: 51.57,49.64 R52.1
N$27
  Top 0.25: U41.3 75.71,15.33 | 73.89,15.33 73.49,15.73 L14.1
  Top 1: 75.71,15.33 73.89,15.33
N$30
  Top 0.5: R51.1 90.15,16.58 | 90.15,16.58 R50.2 | U1.3 86.51,16.94 86.87,16.58 90.15,16.58
N$31
  Top 0.5: U1.6 88.41,15.38 89.02,14.77 R48.2
N$32
  Top 0.203: R75.1 52.4,19.83 52.82,19.41 54.8,19.41 54.95,19.27 58.15,19.27 Q9.1
N$33
  Top 0.3: R41.1 R36.2 66.08,20.11 67.28,18.91 68.85,18.91 68.97,18.78 78,18.78 78.43,18.35 U41.5
N$34
  Top 0.203: R46.2 45.89,14.73 Q2.1
N$38
  Top 0.203: R74.1 54.24,18.46 Q10.1
N$40  (via drill 0.35)
  Top 0.203: v53.03,13.65 53.03,9.22 54.86,7.39
  Top 0.3: R72.2 19.66,33.5 v19.53,33.5 | 54.86,7.39 U6.2
  Bottom 0.203: 49.44,17.44 49.67,17.44 52.97,14.14 52.97,13.65 v53.03,13.65
  Bottom 0.3: v19.53,33.5 20.78,34.75 25.25,34.75 25.24,34.74 33.85,26.13 33.85,20.27 36.68,17.44 49.44,17.44
N$42  (via drill 0.35)
  Top 0.203: U6.3 54.68,8.66 53.93,9.41 53.93,14.2 v53.82,14.31
  Top 0.3: v20.81,37.4 20.81,36.69 R71.2 | v38.79,38.05 38.87,38.05 38.87,36.74 37.65,35.52 v36.98,35.52 | 55.25,8.51 U6.3
  Bottom 0.203: 26.11,38.07 28.03,38.07 | 28.35,38.07 29.25,38.97 32.95,38.97 33.87,38.05 | 50.29,19.34 50.32,19.34 53.66,16 53.82,15.84 v53.82,14.31
  Bottom 0.3: v20.81,37.4 21.48,38.07 26.11,38.07 | 28.03,38.07 28.35,38.07 | 33.87,38.05 v38.79,38.05 | v36.98,35.52 37,35.5 37,22.88 35.96,21.84 35.96,20.97 37.59,19.34 50.29,19.34
PENI  (via drill 0.35)
  Top 0.203: 51.88,47.48 52.09,47.69 61.95,47.69 v62.15,47.9 | R35.2 36.98,37.13 R43.1 37.59,39.27 38.56,39.27 39,39.71 39,42.28 39.11,42.39 v39.37,42.39 | U8.7 47.61,48.28 47.61,47.76 47.76,47.62 47.76,47.48 | v62.17,45.39 63.13,46.34 75.33,46.34 75.79,45.89 75.79,42.38 75.09,41.68 74.55,41.68 P2.4
  Top 0.3: 47.76,47.48 51.88,47.48
  Bottom 0.203: v39.37,42.39 39.42,42.39 39.42,42.17 39.98,41.61 41.74,41.61 41.74,41.77 42.93,42.96 | 62.02,45.24 v62.17,45.39 62.17,47.88 v62.15,47.9
  Bottom 0.3: 42.93,42.96 42.93,43.29 44.88,45.24 62.02,45.24
RTS
  Top 0.203: Q9.2 55.88,16.94 R74.2 55.31,16.94 52.86,14.49 52.78,14.49 52.35,14.06 52.35,10.06 51.59,9.3 51.09,9.3 U6.14
RXD  (via drill 0.35)
  Top 0.152: R12.1 80.55,41.87 85.34,37.08 85.34,36.97 v86,36.31
  Top 0.203: J4.A5 95.3,11.05 v94.86,11.49 | v94.91,13.79 95.17,14.05 J4.B5 | v95.43,15.74 94.77,16.4 94.77,18.5 94.75,18.5 94.75,22.68 96.4,24.33 v96.54,24.33
  Bottom 0.203: v94.86,11.49 94.86,13.74 | 94.86,13.74 v94.91,13.79 | 94.86,13.74 94.86,14.41 95.41,14.96 95.41,15.72 v95.43,15.74 | v96.54,24.33 96.54,24.88 95.01,26.41 92.93,26.41 86.43,32.91 86.43,35.88 v86,36.31
TXD  (via drill 0.35)
  Top 0.152: 95.5,22.64 96.39,23.53 97.14,23.53 97.46,23.85 v97.46,25.08 | R6.1 90.01,41.96 89.97,41.91 89.97,37.33 v89.44,36.8
  Top 0.203: J4.B8 98.91,10.55 99.41,11.05 99.41,13.13 99.21,13.33 | J4.A8 98.99,13.55 99.21,13.33 | 99.21,13.33 100.46,14.58 100.46,17.25 98.53,19.18 95.77,19.18 95.15,19.8 95.15,22.29 95.5,22.64
  Bottom 0.152: v97.46,25.08 95.64,26.9 93.18,26.9 86.83,33.25 86.83,36.15 87.56,36.88 89.36,36.88 v89.44,36.8
UART0_RXD0  (via drill 0.35)
  Top 0.203: Q8.2 38.39,44.47 38.39,43.29 R60.1 37.21,41.91 v38.21,40.91 v38.22,40.91 | R72.1 18.23,33.59 v17.98,33.59
  Top 0.3: U2.36 15.87,30.37 17.56,32.05 17.56,32.92 R72.1
  Bottom 0.203: v38.22,40.91 38.09,41.04 18.19,41.04 15.89,38.74 15.89,38.2 16.28,37.81 16.76,37.81 16.76,34.62 17.79,33.59 v17.98,33.59
UART0_RXD0-  (via drill 0.35)
  Top 0.152: v43.48,21.88 43.48,21.47 43.73,21.22 43.73,20.72 43.23,20.22 43.23,17.11 41.88,15.77 | 41.88,9.41 J1.1
  Top 0.203: 40.07,38.55 40.97,39.45 40.97,41.49 40.59,41.88 40.59,42.97 39.66,43.89 39.66,45.44 37.62,47.48
  Top 0.3: Q8.3 35,45.55 36.93,47.48 R59.1 37.62,47.48 | v39,34.99 38.85,35.14 40.07,36.35 40.07,38.55
  Top 0.524: 41.88,15.77 41.88,9.41
  Bottom 0.203: 38.29,22.13 38.29,21.09 38.66,20.72 41.84,20.72 43,21.88 v43.48,21.88
  Bottom 0.3: v39,34.99 39,34.83 38.29,34.12 38.29,22.13
UART0_TXD0  (via drill 0.35)
  Top 0.3: 14.57,30.02 15.96,31.41 15.96,36.35 16.66,37.05 | R71.1 19.21,36.77 16.66,36.77 16.66,37.05 | 16.66,37.05 16.66,38.47 v16.71,38.52 | v26.36,40.36 26.36,40.38 26.47,40.49 26.47,40.5
  Top 0.5: U2.37 14.57,28.71 14.57,30.02 | v26.36,40.36 v26.36,40.35 25.85,39.84 R27.2 | 26.47,40.5 27.03,40.5 Q7.2
  Bottom 0.3: v16.71,38.52 18.41,40.22 26.5,40.22 v26.36,40.36
UART0_TXD0-  (via drill 0.35)
  Top 0.152: v43.12,20.97 42.85,20.7 42.85,17.68 39.86,14.69
  Top 0.203: 39.54,38.85 40.2,39.51 v40.2,40.88 | 30.21,42.79 30.21,42.3
  Top 0.3: Q7.3 29.46,41.54 30.21,42.3 30.21,42.32 v30.24,42.32 | 30.21,42.79 30.84,43.41 31.23,43.41 R44.1 | v37.84,34.71 37.87,34.74 37.87,34.91 39.54,36.58 39.54,38.85
  Top 0.5: 39.86,14.69 J1.2
  Bottom 0.152: 42.22,20.31 42.88,20.97 v43.12,20.97
  Bottom 0.203: 37.67,23.08 37.67,20.95 38.31,20.31 42.22,20.31
  Bottom 0.3: v40.2,40.88 39.84,40.88 38.37,42.35 30.27,42.35 v30.24,42.32 | 37.67,23.08 37.67,34.55 v37.84,34.71
USB_DN  (via drill 0.35)
  Top 0.203: 94.89,12.56 92.23,12.56 91.64,13.16 66.13,13.16 v65.84,12.87 | J4.A7 95.26,12.56 | J4.B7 96.06,11.55 95.22,12.4
  Top 0.25: 95.22,12.4 95.22,12.52 | 95.22,12.52 95.26,12.56 | 94.89,12.56 95.17,12.56 95.22,12.52
  Top 0.3: U6.6 55.55,12.62 57.4,12.62 v57.52,12.74
  Bottom 0.203: v57.52,12.74 65.7,12.74 v65.84,12.87
USB_DP  (via drill 0.35)
  Top 0.203: v64.94,12.02 64.82,12.14 64.82,13.31 65.08,13.57 91.98,13.57 92.5,13.05 97.06,13.05 J4.B6 98.74,13.05
  Top 0.3: U6.5 56.95,11.2 57.18,11.42 v57.18,11.76 | J4.A6 98.77,12.05 98.89,12.17 98.89,12.91 98.74,13.05
  Bottom 0.203: v57.18,11.76 64.68,11.76 v64.94,12.02
VBUS  (via drill 0.35)
  Top 0.152: R18.1 77.68,48.88 77.69,48.88 | C23.1 81.97,45.56
  Top 0.203: v93.63,14.34 93.63,14.65 | 93.63,14.65 93.63,14.97 93.94,15.29 | 94.39,14.71 93.69,14.71 93.63,14.65 | 79,28.95 79.42,29.37 v79.46,29.41 | CHR.+ 105.31,39.71 105.31,37.7 104.7,37.09 104.7,36.35 104.33,35.98 103.09,35.98 102.45,36.62 101.31,36.62 100.34,35.66 100.34,35.18
  Top 0.25: U3.2 83.11,46.06
  Top 0.28: 96.89,29.76 96.89,25.75 94.25,23.11 94.25,15.59 93.94,15.29
  Top 0.3: J4.A9 97.77,14.68 97.71,14.68 J4.B4 | D5.A 78.63,27.58 76.97,25.92 71.83,25.92 71.54,25.63 71.54,23.58 72.91,22.22 R25.2 | P10.P$1 94.03,9.66 94.28,9.91 | 96.89,29.76 100.34,33.21 100.34,35.18 | J4.B4 J4.A9 | J4.A9 | J4.B4 97.34,14.55 97.18,14.71 | 97.55,9.75 J4.A4 J4.B9 97.59,9.79 97.55,9.75 | 97.55,9.75 97.4,9.91 | 83.11,46.06 82.53,46.06 C23.1 | 78.75,44.72 81.13,44.72 81.97,45.56
  Top 0.5: 97.18,14.71 94.39,14.71
  Top 0.6: 97.4,9.91 94.28,9.91
  Top 1: U26.4 C20.1 81.24,50.29 C19.2 79.09,50.29 77.69,48.88 77.69,48.31 78.75,47.24 78.75,44.72 78.75,33.78 | 78.75,33.78 78.96,33.57 v79.02,33.63 | 93.47,9.66 94.03,9.66 | 78.75,33.78 78.64,33.68 v78.03,33.68 | v78.44,29.2 79.25,29.2 79.42,29.37 | D5.A 78.63,28.58 79,28.95
  Top 1.5: v82.67,11.34 82.95,11.62 91.5,11.62 v92.33,10.79 93.47,9.66
  Bottom 1: v79.02,33.63 79.02,32.24 78.03,33.23 v78.03,33.68 | v79.46,29.41 v79.45,29.41 79.34,29.52 79.34,29.54 79.02,29.87 79.02,28.68 78.5,29.2 v78.44,29.2 | v82.67,11.34 81.68,10.35 82.04,10.35 v83.5,11.81 | v92.33,10.79 92.37,10.79 93.26,11.68 | 93.26,11.68 93.63,12.05 v93.63,14.34 93.63,14.46 v94.19,15.03 | 93.26,11.68 93.26,10.62 v93.16,10.52
  Bottom 1.5: 79.02,32.24 79.02,29.87 | 79.02,28.68 79.02,11.38 80.04,10.35 81.68,10.35
VCC_3V3  (via drill 0.35)
  Top 0.2: R41.2 64.34,19.98 63.01,19.98 | C30.2 64.95,17.15 C39.2
  Top 0.203: v36.15,44.8 36.15,44.8 Q8.1 | 62.22,17.37 61.84,17.37 C6.1 | 62.22,17.37 63.01,17.37 | 62.22,17.37 62.55,17.7 62.98,17.28 C30.2 | C39.2 66.83,17.24 C5.+ | v76.05,40.06 75.93,40.18 P2.1 71,39.85 | LCD.7 47.23,39.73 C7.1 47.17,40.33 47.24,40.39 | C38.2 82.73,33.18 82.5,33.41 | 82.5,33.41 84.12,33.41 | 84.12,33.41 84.14,33.41 R8.2 | v80.64,39.87 80.52,39.75 80.52,35.39 82.5,33.41 | 84.12,33.41 86.01,35.3 v87.67,35.3 | 25.09,42.79 24.81,43.07 v24.58,43.07 | C13.1 33.13,38.73 33.24,38.85
  Top 0.25: LCD.6 47.4,40.23 47.24,40.39 | 48.6,26.42 48.91,26.73 LCD.33 58.75,26.73
  Top 0.28: C26.1 19.58,43.34 R38.2 R37.2 21.08,38.61 R28.1 | C9.2
  Top 0.3: 47.2,41.49 C31.2 | U8.1 46.01,42.68 45.83,42.87 45.83,42.89 | Q8.1 35.49,42.39 R60.2 35.45,41.88 C15.2 35.45,38.83 | 35.45,38.83 R43.2 | 48.6,26.42 C33.2 | R45.1 95.84,28.42 95.74,28.52 95.74,28.68 v95.56,28.68 | C12.1 33.24,38.85 35.44,38.85 35.45,38.83 | Q5.1 27.42,45.95 28.32,45.05 28.32,42.9 Q7.1 28.46,40.97 28.46,39.02 Q4.1
  Top 0.5: R40.2 22.05,50.66 23,50.66 C10.1 22.84,50.82 24.57,50.82 | R40.2 R33.1 | 24.57,50.82 C34.2 | 12.06,9.22 C32.+ | C32.+ 12.28,8.84 | 11.24,8.84 C32.+ | 13.7,7.42 C8.1 | 24.57,50.82 26.22,50.82 R56.2 26.95,50.53 27.63,50.53 Q6.1 | R40.2 18.68,50.34 17.88,51.14 14.48,51.14 13.24,49.9 13.24,44.55 14.54,43.26 J14.4 17.65,43.31 v16.34,43.31 19.5,43.31 C26.1 | Q5.1 25.81,44.44 C4.2 25.09,44.11 25.09,42.79 R55.2 | R27.1 25.86,37.92 R42.1 27.34,37.89 Q4.1 | U6.16 50.45,4.03 50.36,3.93 | U6.4 59.96,9.93 60.12,10.09 | C5.+ 67.53,17.25 67.7,17.08
  Top 0.6: 46.01,42.68 47.2,41.49
  Top 0.8: C31.2 47.24,40.39
  Top 1: U2.2 12.06,9.22 | 13.7,7.42 12.28,8.84 | 11.24,8.84 9.3,6.91 9.3,4.64 10.01,3.93 | C11.2 | C11.2 52.54,51.14 | R52.2 52.54,51.14 | 52.54,51.14 52.54,52.66 44.59,52.66 | 44.59,52.66 43.37,51.43 v43.37,50.68 43.37,45.04 43.52,45.19 44.87,43.85 | 44.87,43.85 v45.31,43.4 45.83,42.89 | 61.31,17.1 61.31,19.94 R13.2 64.41,20.05 R41.2 | R19.2 56,51.14 C11.2 | 63.01,17.37 63.01,19.98 63.01,26.6 | 63.01,26.6 63.01,33.81 62.91,33.91 62.91,38.66 60.03,41.54 | 60.03,41.54 59.3,42.27 59.3,42.68 v59.02,42.68 | 71,39.85 70.94,39.79 v70.94,37.85 C9.2 | 58.75,26.73 62.88,26.73 63.01,26.6 | v28.55,46.26 28.24,45.95 27.42,45.95 | 60.03,41.54 60.03,42.27 v60.12,42.35 | 44.87,43.85 44.87,43.17 v44.5,42.8 | 44.59,52.66 40.74,52.66 v40.52,52.43 v40.51,52.44 | v32.3,51.85 32.3,50.44 | 32.3,50.44 C28.2 | J5.3 32.52,51.93 | 32.52,51.93 32.52,50.66 32.3,50.44 | 27.63,50.53 29.22,52.11 32.34,52.11 32.52,51.93
  Top 1.2: 10.01,3.93 50.36,3.93 58.02,3.93 60.12,6.03 60.12,10.09 60.12,16.24 60.98,17.1 61.31,17.1 61.33,17.08 67.7,17.08 70.97,17.08 70.97,16.83 L14.2
  Bottom 0.203: 39.99,47.37 37.42,44.8 v36.15,44.8 | v76.05,40.06 80.15,40.06 80.34,39.87 v80.64,39.87 | v87.67,35.3 88.67,35.3 90.35,33.62 90.35,31.76 93.56,28.55 95.56,28.55
  Bottom 0.3: v43.37,50.68 43.3,50.68 | v95.56,28.68 95.56,28.55
  Bottom 1: 43.3,50.68 39.99,47.37 38.9,46.27 v28.55,46.27 | v59.02,42.68 58.39,42.68 | 58.39,42.68 54.32,42.68 54.21,42.79 45.24,42.79 | 45.24,42.79 44.97,43.06 v45.3,43.4 v45.31,43.4 | 58.39,42.68 58.42,42.71 63.12,42.71 65.41,45 65.41,45.28 70.27,45.28 70.29,45.26 70.29,38.5 v70.94,37.85 | v28.55,46.27 v28.55,46.26 | v28.55,46.27 26.73,46.27 26.64,46.36 24.58,44.3 v24.58,43.07 24.51,43.14 16.5,43.14 v16.34,43.31 | 45.24,42.79 v44.51,42.79 v44.5,42.8 | v40.51,52.44 32.89,52.44 v32.3,51.85
VIN
  Top 0.203: 83.42,15.49 83.4,15.51 | 80.78,21.29 80.78,21.49
  Top 0.3: U41.4 78.49,15.45 | 80,15.45 C22.2 | 80.34,15.45 C22.2 | C36.2 82.39,15.85 82.63,15.61 82.79,15.45 | 84.95,15.41 C43.2 84.72,15.49 | U41.1 75.95,17.56 77.15,17.56 77.6,17.11 77.6,16.82 77.88,16.54 79.48,16.54 79.66,16.37 79.93,16.37 80.17,16.13 C22.2
  Top 0.5: U1.5 U1.4
  Top 0.8: 80,15.45 78.49,15.45 | 83.4,15.51 83.4,18.67
  Top 1: 82.79,15.45 80.34,15.45 | U1.4 84.95,15.41 | 84.72,15.49 83.42,15.49 C36.2 | 83.4,18.67 80.78,21.29 | L6.1 78.93,22.11 77.34,23.7 D3.C | C40.1 76.34,21.65 C16.2 | C16.2 78.24,21.66 76.94,21.66 75.21,23.39 D3.C | D3.C 73.95,23.7 73.67,23.41 73.67,23.59 Q3.2 | 80.62,21.65 D5.C | C16.2 80.62,21.65 | 80.62,21.65 80.78,21.49
XL
  Top 0.25: U8.4 47.51,44.95 47.74,45.18 48.46,45.18 49.01,44.63 49.01,43.38 49.66,42.73 LCD.1
XR
  Top 0.25: U8.2 46.51,43.6 48.38,41.73 LCD.3
YD
  Top 0.25: U8.3 47.01,45.22 47.44,45.65 48.88,45.65 50.86,43.67 52.37,43.67 53.15,42.89 53.15,41.52 52.86,41.23 LCD.4
YU
  Top 0.25: U8.5 48.01,43.33 49.11,42.23 LCD.2

## Text on the board
tPlace: V2.0 | www.elecrow.com | SKU: DLC35010R (RGB) | ESP32 Terminal - 3.5 Inch | 5V | IO19 | 3.3V | GND | IO40 | GND | - | + | RESET | CHR | T1 | T2 | BOOT | PWR | GND | 5V | TX | RX | GND | 5V | SDA | SCL | IO43-TX | IO39-SCL | IO44-RX | IO38-SDA | IO20